# EAGLE design Main_BoardV1 (EAGLE 9.6.2)
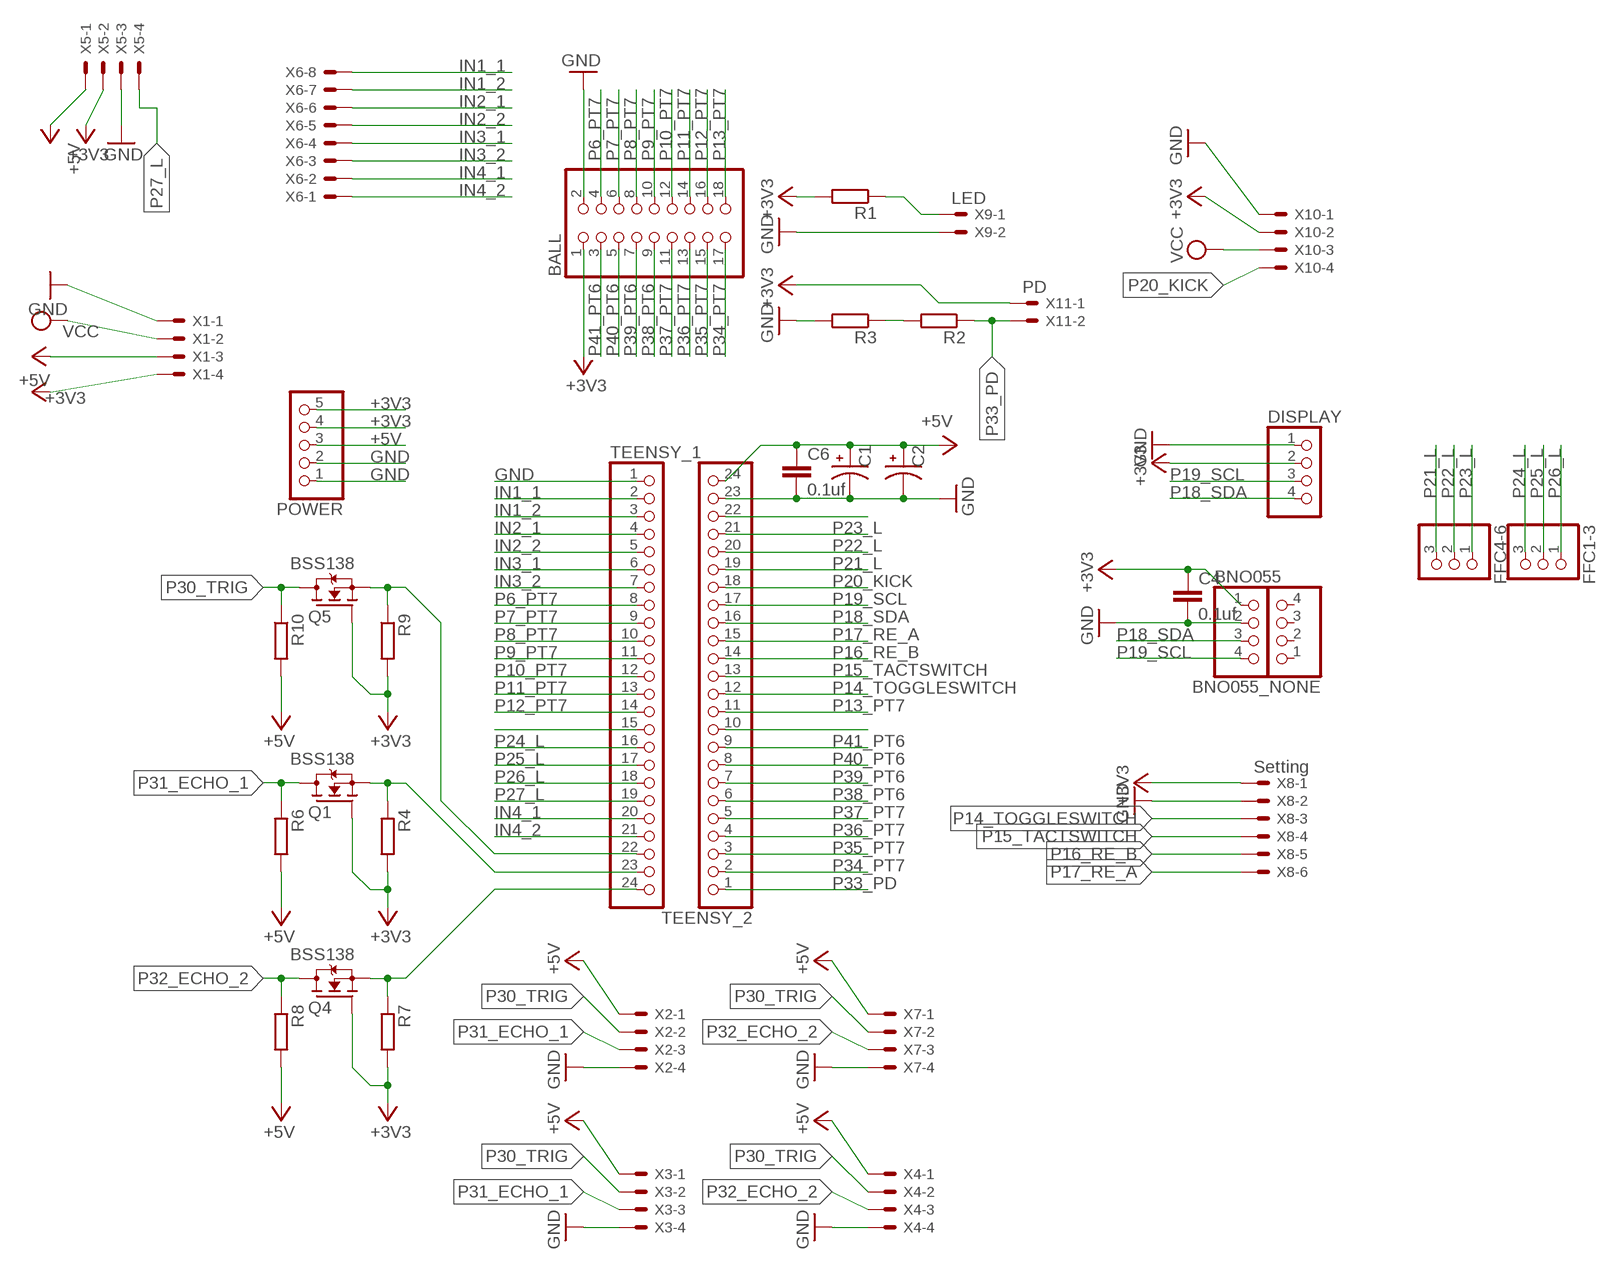
[diagram p0: schematic, sheet 1]

## Parts
BALL  PINHD-2X9  [2X09]
BNO055  PINHD-1X4  [1X04]
BNO055_NONE  PINHD-1X4  [1X04]
C1  EEEFK1E332AM  [CAP_EEEFK1E332AM]
C2  EEEFK1E332AM  [CAP_EEEFK1E332AM]
C4  0.1uf  C-EUC0603  [C0603]
C6  0.1uf  C-EUC0603  [C0603]
DISPLAY  PINHD-1X04_2.54-S  [1X04-S]
FFC1-3  PINHD-1X03_2.54-S  [1X03-S]
FFC4-6  PINHD-1X03_2.54-S  [1X03-S]
POWER  PINHD-1X05_2.54-S  [1X05-S]
Q1  BSS138  [SOT95P240X111-3N]
Q4  BSS138  [SOT95P240X111-3N]
Q5  BSS138  [SOT95P240X111-3N]
R1  R-EU_R0603  [R0603]
R2  R-EU_R0603  [R0603]
R3  R-EU_R0603  [R0603]
R4  R-EU_R0603  [R0603]
R6  R-EU_R0603  [R0603]
R7  R-EU_R0603  [R0603]
R8  R-EU_R0603  [R0603]
R9  R-EU_R0603  [R0603]
R10  R-EU_R0603  [R0603]
TEENSY_1  PINHD-1X24  [1X24]
TEENSY_2  PINHD-1X24  [1X24]
X1  Power  JST-XH-04-PIN-LONG-PAD  [JST-XH-04-PACKAGE-LONG-PAD]
X2  JST-XH-04-PIN-LONG-PAD  [JST-XH-04-PACKAGE-LONG-PAD]
X3  JST-XH-04-PIN-LONG-PAD  [JST-XH-04-PACKAGE-LONG-PAD]
X4  JST-XH-04-PIN-LONG-PAD  [JST-XH-04-PACKAGE-LONG-PAD]
X5  JST-XH-04-PIN-ROUND-PAD  [JST-XH-04-PACKAGE-ROUND-PAD]
X6  Motor  JST-XH-08-PIN-ROUND-PAD  [JST-XH-08-PACKAGE-ROUND-PAD]
X7  JST-XH-04-PIN-LONG-PAD  [JST-XH-04-PACKAGE-LONG-PAD]
X8  Setting  JST-XH-06-PIN-ROUND-PAD  [JST-XH-06-PACKAGE-ROUND-PAD]
X9  LED  JST-XH-02-PIN-ROUND-PAD  [JST-XH-02-PACKAGE-ROUND-PAD]
X10  Kicker  JST-XH-04-PIN-ROUND-PAD  [JST-XH-04-PACKAGE-ROUND-PAD]
X11  PD  JST-XH-02-PIN-ROUND-PAD  [JST-XH-02-PACKAGE-ROUND-PAD]

## Nets
+3V3: BALL.1 BNO055.1 C4.1 DISPLAY.2 POWER.4 POWER.5 Q1.1(G) Q4.1(G) Q5.1(G) R1.2 R4.2 R7.2 R9.2 X1.4 X5.2 X8.1 X10.2 X11.1
+5V: C1.1 C2.1 C6.1 POWER.3 R6.2 R8.2 R10.2 TEENSY_2.24 X1.3 X2.1 X3.1 X4.1 X5.1 X7.1
GND: BALL.2 BNO055.2 C1.2 C2.2 C4.2 C6.2 DISPLAY.1 POWER.1 POWER.2 R3.2 TEENSY_1.1 TEENSY_2.23 X1.1 X2.4 X3.4 X4.4 X5.3 X7.4 X8.2 X9.2 X10.1
IN1_1: TEENSY_1.2 X6.8
IN1_2: TEENSY_1.3 X6.7
IN2_1: TEENSY_1.4 X6.6
IN2_2: TEENSY_1.5 X6.5
IN3_1: TEENSY_1.6 X6.4
IN3_2: TEENSY_1.7 X6.3
IN4_1: TEENSY_1.20 X6.2
IN4_2: TEENSY_1.21 X6.1
N$1: R1.1 X9.1
N$2: R2.2 R3.1
N$3: TEENSY_2.22
N$5: Q1.2(S) R4.1 TEENSY_1.23
N$7: Q4.2(S) R7.1 TEENSY_1.24
N$9: Q5.2(S) R9.1 TEENSY_1.22
N$16: TEENSY_2.10
N$35: TEENSY_1.15
P6_PT7: BALL.4 TEENSY_1.8
P7_PT7: BALL.6 TEENSY_1.9
P8_PT7: BALL.8 TEENSY_1.10
P9_PT7: BALL.10 TEENSY_1.11
P10_PT7: BALL.12 TEENSY_1.12
P11_PT7: BALL.14 TEENSY_1.13
P12_PT7: BALL.16 TEENSY_1.14
P13_PT7: BALL.18 TEENSY_2.11
P14_TOGGLESWITCH: TEENSY_2.12 X8.3
P15_TACTSWITCH: TEENSY_2.13 X8.4
P16_RE_B: TEENSY_2.14 X8.5
P17_RE_A: TEENSY_2.15 X8.6
P18_SDA: BNO055.3 DISPLAY.4 TEENSY_2.16
P19_SCL: BNO055.4 DISPLAY.3 TEENSY_2.17
P20_KICK: TEENSY_2.18 X10.4
P21_L: FFC4-6.3 TEENSY_2.19
P22_L: FFC4-6.2 TEENSY_2.20
P23_L: FFC4-6.1 TEENSY_2.21
P24_L: FFC1-3.3 TEENSY_1.16
P25_L: FFC1-3.2 TEENSY_1.17
P26_L: FFC1-3.1 TEENSY_1.18
P27_L: TEENSY_1.19 X5.4
P30_TRIG: Q5.3(D) R10.1 X2.2 X3.2 X4.2 X7.2
P31_ECHO_1: Q1.3(D) R6.1 X2.3 X3.3
P32_ECHO_2: Q4.3(D) R8.1 X4.3 X7.3
P33_PD: R2.1 TEENSY_2.1 X11.2
P34_PT7: BALL.17 TEENSY_2.2
P35_PT7: BALL.15 TEENSY_2.3
P36_PT7: BALL.13 TEENSY_2.4
P37_PT7: BALL.11 TEENSY_2.5
P38_PT6: BALL.9 TEENSY_2.6
P39_PT6: BALL.7 TEENSY_2.7
P40_PT6: BALL.5 TEENSY_2.8
P41_PT6: BALL.3 TEENSY_2.9
VCC: X1.2 X10.3
Unconnected: BNO055_NONE.1 BNO055_NONE.2 BNO055_NONE.3 BNO055_NONE.4

## Library data of the parts
BALL = pinhead:PINHD-2X9: PIN HEADER
BNO055 BNO055_NONE = pinhead:PINHD-1X4: PIN HEADER
C1 C2 = EEEFK1E332AM:EEEFK1E332AM: Check availability <https://pricing.snapeda.com/parts/EEEFK1E332AM/Panasonic/view-part?ref=eda>; AVAILABILITY: In Stock; DESCRIPTION: 3300µF 25V Aluminum Electrolytic Capacitors Radial, Can - SMD 5000 Hrs @ 105°C; MF: Panasonic; MP: EEEFK1E332AM; PACKAGE: RADIAL-2 Panasonic; PRICE: None; PURCHASE-URL: https://pricing.snapeda.com/search/part/EEEFK1E332AM/?ref=eda
C4 C6 = rcl:C-EU: CAPACITOR, European symbol; SPICEPREFIX: C
DISPLAY = pinhead-2:PINHD-1X04: PIN HEADER
FFC1-3 FFC4-6 = pinhead-2:PINHD-1X03: PIN HEADER
POWER = pinhead-2:PINHD-1X05: PIN HEADER
Q1 Q4 Q5 = BSS138:BSS138: N-Channel 50V 220mA (Ta) 360mW (Ta) Surface Mount SOT-23-3 Check availability <https://pricing.snapeda.com/parts/BSS138/ON%20Semiconductor/view-part?ref=eda>; AVAILABILITY: In Stock; DESCRIPTION: N-Channel 50 V 200mA (Ta) 225mW (Ta) Surface Mount SOT-23-3 (TO-236); MF: ON Semiconductor; MP: BSS138; PACKAGE: SOT-23 ON; PRICE: None; PURCHASE-URL: https://pricing.snapeda.com/search/part/BSS138/?ref=eda
R1-R4 R6-R10 = rcl:R-EU_: RESISTOR, European symbol; SPICEPREFIX: R
TEENSY_1 TEENSY_2 = pinhead:PINHD-1X24: PIN HEADER
X1-X4 X7 X10 = JST XH Connectors v1-0:JST-XH-04-PIN: JST XH Connector 2 Pin Wire to board connector. Pitch: 2,54 mm, (0.100") Number of pins: 4 Created by Rembrandt Electronics www.rembrandtelectronics.com
X5 = Rembrandt Electronics - JST XH Connectors v1-0:JST-XH-04-PIN: JST XH Connector 2 Pin Wire to board connector. Pitch: 2,54 mm, (0.100") Number of pins: 4 Created by Rembrandt Electronics www.rembrandtelectronics.com
X6 = Rembrandt Electronics - JST XH Connectors v1-0:JST-XH-08-PIN: JST XH Connector 2 Pin Wire to board connector. Pitch: 2,54 mm, (0.100") Number of pins: 8 Created by Rembrandt Electronics www.rembrandtelectronics.com
X8 = JST XH Connectors v1-0:JST-XH-06-PIN: JST XH Connector 2 Pin Wire to board connector. Pitch: 2,54 mm, (0.100") Number of pins: 6 Created by Rembrandt Electronics www.rembrandtelectronics.com
X9 X11 = JST XH Connectors v1-0:JST-XH-02-PIN: JST XH Connector 2 Pin Wire to board connector. Pitch: 2,54 mm, (0.100") Number of pins: 2 Created by Rembrandt Electronics www.rembrandtelectronics.com

## Board
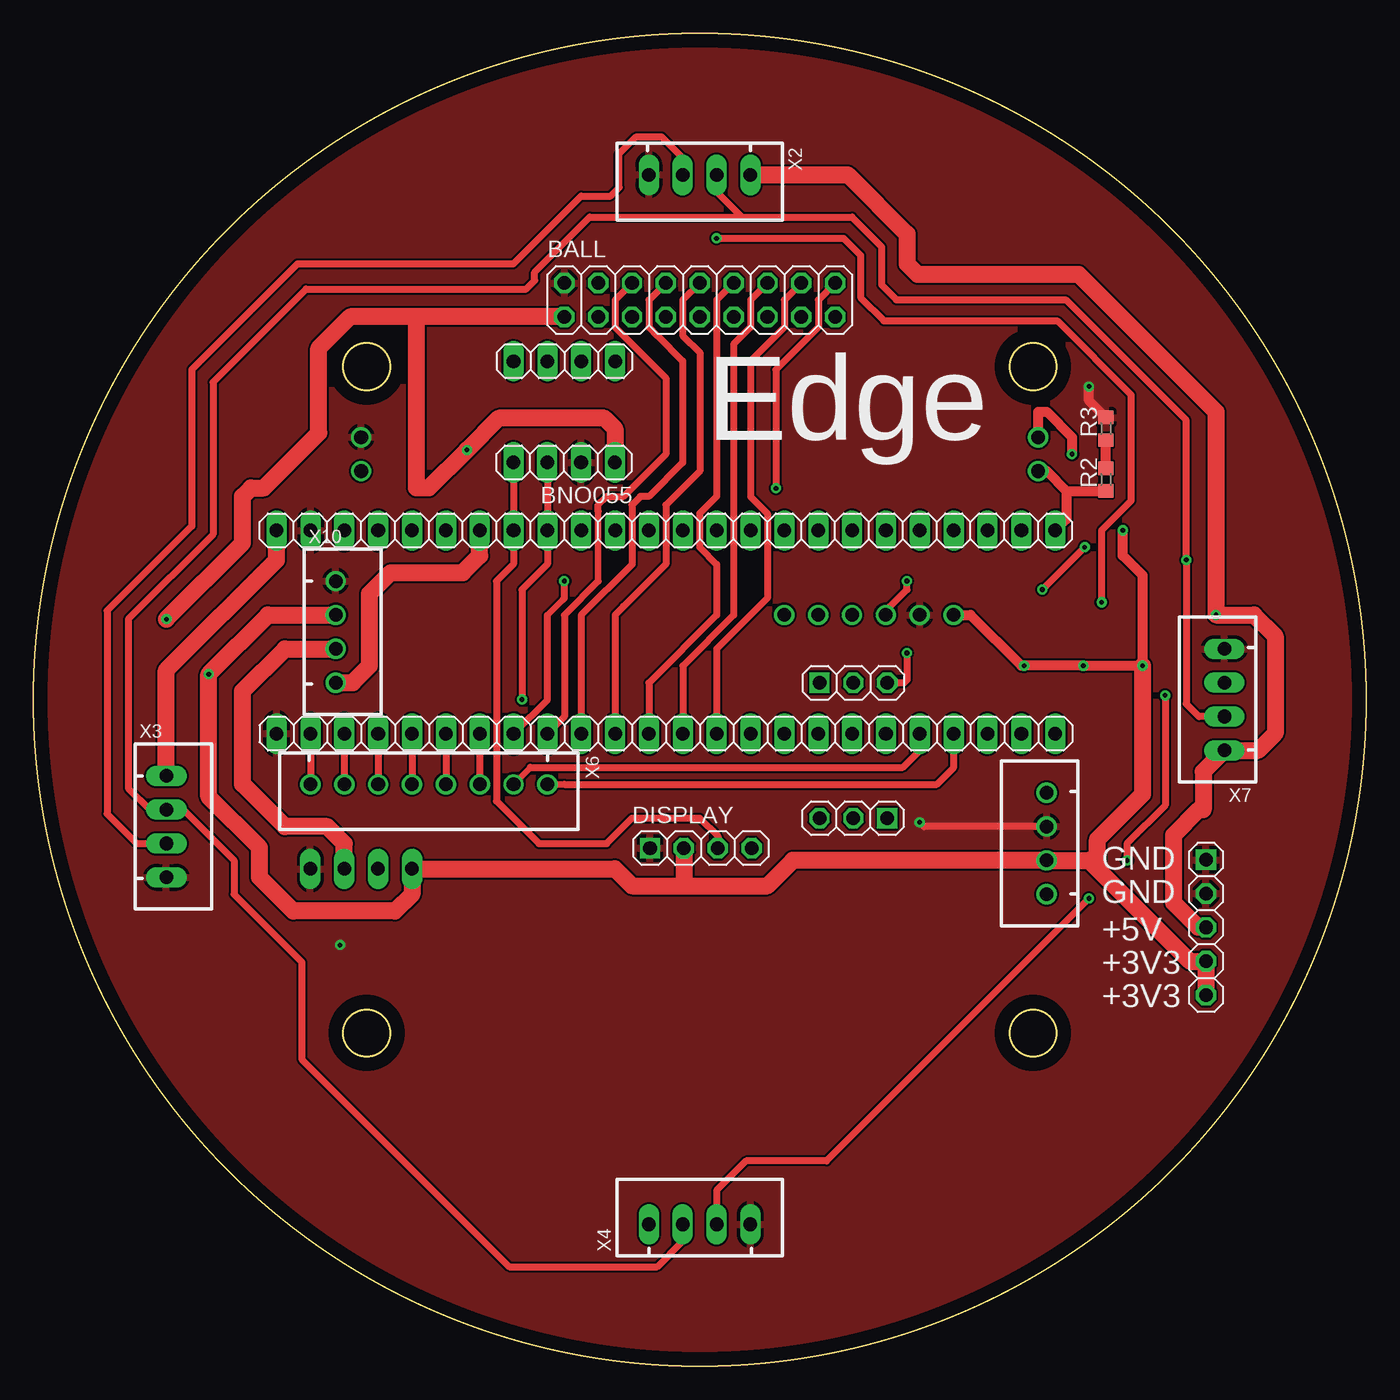
[diagram p1: board, top side]
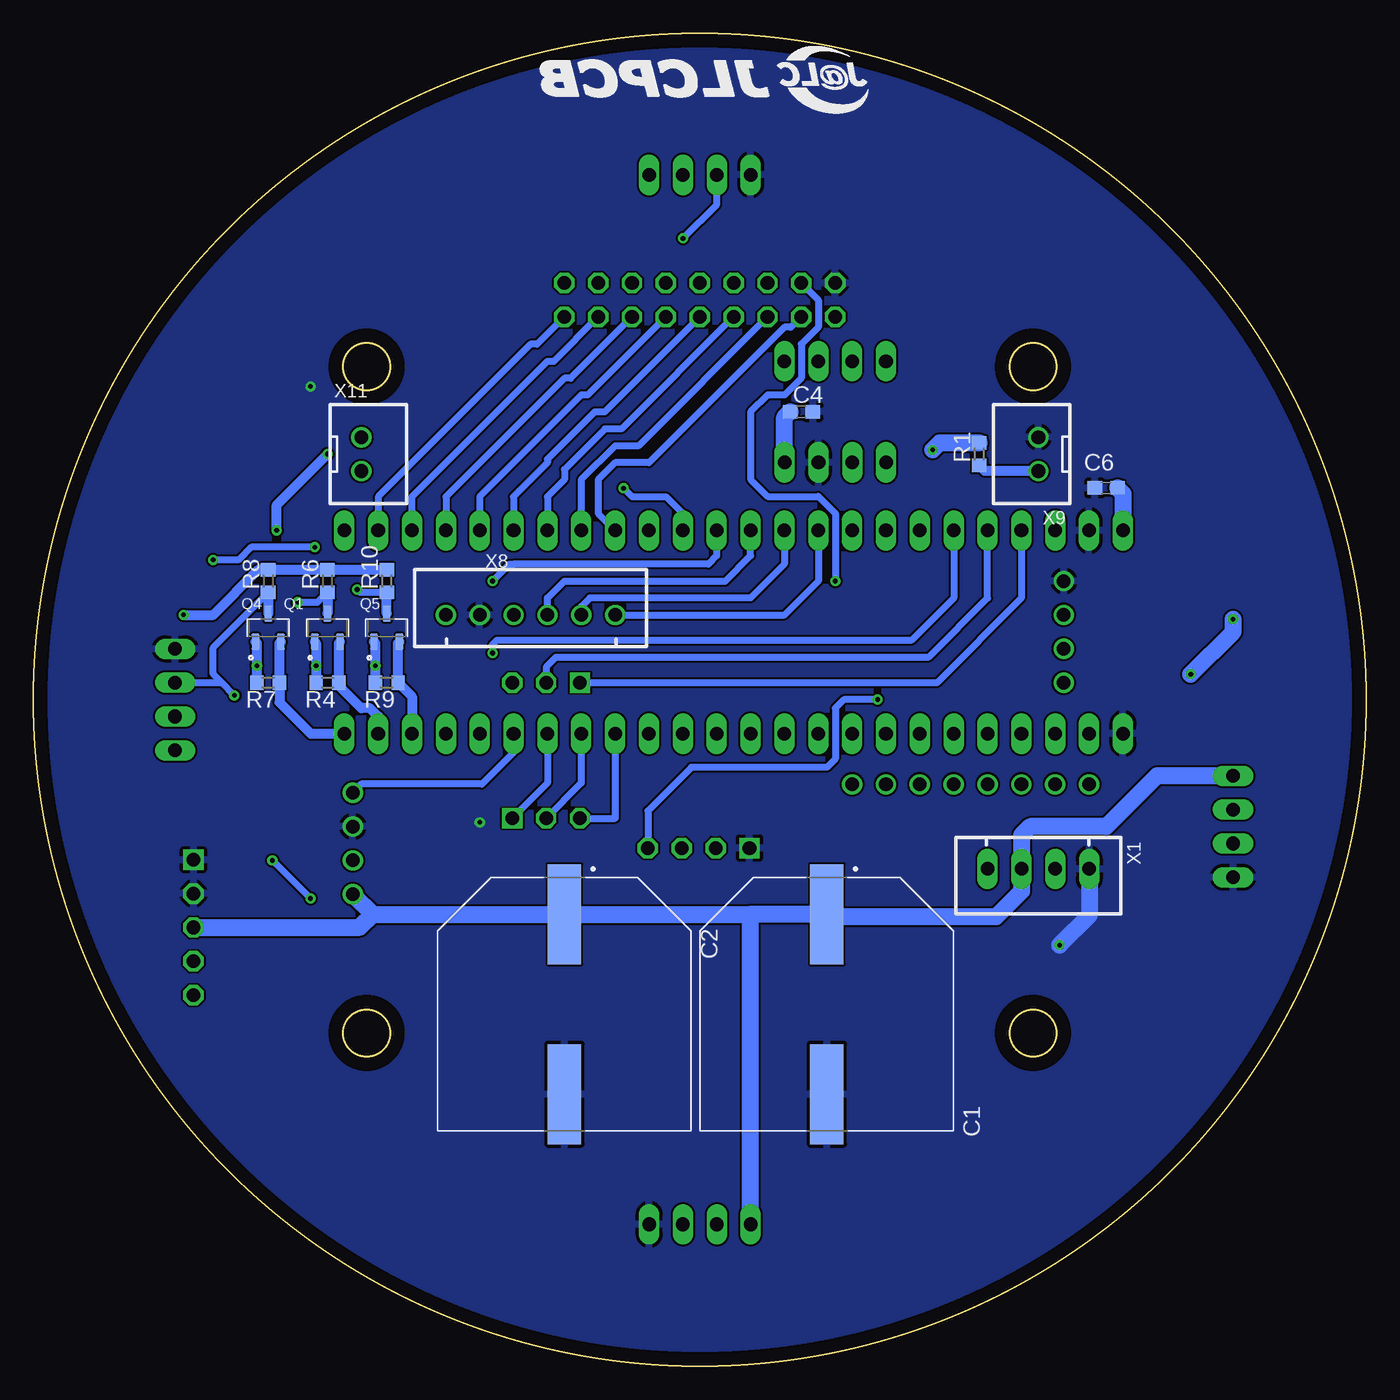
[diagram p2: board, bottom side, seen from below]

Size 100 x 100 mm. Coordinates in mm from the lower left corner, seen from the top.
Outline: circle at 50,50 radius 50
Outline: circle at 75,75 radius 1.75
Outline: circle at 25,75 radius 1.75
Outline: circle at 25,25 radius 1.75
Outline: circle at 75,25 radius 1.75
Copper layers (1*16): Top 0.035mm / dielectric 1.5mm / Bottom 0.035mm
Design rules "default": minimum track width 6mil, minimum drill 0.35mm, track to track 6mil, track to pad 6mil, pad to pad 6mil, via to via 6mil, smd to smd 6mil, copper to edge 40mil, drill to drill 6mil, minimum pad ring 10mil, minimum via ring 8mil, stop-mask expansion 4mil, vias tented up to drill 0mil, thermal gap 10mil

### Footprints (pad centres in the part's own frame; a part is rotated, then mirrored left to right if it is on the bottom)
2X09 = drill 1.016 octagon: 1 -10.16,-1.27; 2 -10.16,1.27; 3 -7.62,-1.27; 4 -7.62,1.27; 5 -5.08,-1.27; 6 -5.08,1.27; 7 -2.54,-1.27; 8 -2.54,1.27; 9 0,-1.27; 10 0,1.27; 11 2.54,-1.27; 12 2.54,1.27; 13 5.08,-1.27; 14 5.08,1.27; 15 7.62,-1.27; 16 7.62,1.27; 17 10.16,-1.27; 18 10.16,1.27
1X04 = drill 1.016 long: 1 -3.81,0; 2 -1.27,0; 3 1.27,0; 4 3.81,0
CAP_EEEFK1E332AM = smd 7.5 x 2.5: 1 -6.75,0; 2 6.75,0
C0603 = smd 1.1 x 1: 1 -0.85,0; 2 0.85,0
1X04-S = drill 1.016 square: 1 -3.81,0 | drill 1.016 octagon: 2 -1.27,0; 3 1.27,0; 4 3.81,0
1X03-S = drill 1.016 square: 1 -2.54,0 | drill 1.016 octagon: 2 0,0; 3 2.54,0
1X05-S = drill 1.016 square: 1 -5.08,0 | drill 1.016 octagon: 2 -2.54,0; 3 0,0; 4 2.54,0; 5 5.08,0
SOT95P240X111-3N = smd 1.23 x 0.6: 1 -1.06,0.95; 2 -1.06,-0.95; 3 1.06,0
R0603 = smd 1 x 1.1: 1 -0.85,0; 2 0.85,0
1X24 = drill 1.016 long: 1 -29.21,0; 2 -26.67,0; 3 -24.13,0; 4 -21.59,0; 5 -19.05,0; 6 -16.51,0; 7 -13.97,0; 8 -11.43,0; 9 -8.89,0; 10 -6.35,0; 11 -3.81,0; 12 -1.27,0; 13 1.27,0; 14 3.81,0; 15 6.35,0; 16 8.89,0; 17 11.43,0; 18 13.97,0; 19 16.51,0; 20 19.05,0; 21 21.59,0; 22 24.13,0; 23 26.67,0; 24 29.21,0
JST-XH-04-PACKAGE-LONG-PAD = drill 1.016 long: 1 -3.81,0; 2 -1.27,0; 3 1.27,0; 4 3.81,0
JST-XH-04-PACKAGE-ROUND-PAD = drill 1.016: 1 -3.81,0; 2 -1.27,0; 3 1.27,0; 4 3.81,0
JST-XH-08-PACKAGE-ROUND-PAD = drill 1.016: 1 -8.89,0; 2 -6.35,0; 3 -3.81,0; 4 -1.27,0; 5 1.27,0; 6 3.81,0; 7 6.35,0; 8 8.89,0
JST-XH-06-PACKAGE-ROUND-PAD = drill 1.016: 1 -6.35,0; 2 -3.81,0; 3 -1.27,0; 4 1.27,0; 5 3.81,0; 6 6.35,0
JST-XH-02-PACKAGE-ROUND-PAD = drill 1.016: 1 -1.27,0; 2 1.27,0

### Placement (x,y rotation side)
BALL  50,80 0 top
BNO055  39.82,67.81 180 top
BNO055_NONE  39.84,75.4 0 top
C1  40.47,27.15 270 bottom
C2  60.15,27.15 270 bottom
C4  42.37,71.6 0 bottom
C6  19.51,65.89 180 bottom
DISPLAY  50.08,38.87 0 top
FFC1-3  61.52,41.11 180 top
FFC4-6  61.52,51.27 0 top
POWER  87.98,32.92 270 top
Q1  77.93,55.41 90 bottom
Q4  82.38,55.41 90 bottom
Q5  73.49,55.41 90 bottom
R1  29.04,68.43 90 bottom
R2  80.47,66.52 90 top
R3  80.47,70.33 90 top
R4  77.93,51.28 180 bottom
R6  77.93,58.9 90 bottom
R7  82.38,51.28 180 bottom
R8  82.38,58.9 90 bottom
R9  73.49,51.28 180 bottom
R10  73.49,58.9 90 bottom
TEENSY_1  47.46,47.46 0 top
TEENSY_2  47.46,62.7 180 top
X1  24.59,37.31 180 bottom
X2  49.99,89.38 180 top
X3  9.99,40.49 270 top
X4  49.99,10.64 0 top
X5  76.03,39.22 90 top
X6  29.68,43.65 180 top
X7  89.36,50.01 90 top
X8  62.69,56.36 0 bottom
X9  24.59,68.43 90 bottom
X10  22.69,55.09 270 top
X11  75.39,68.43 270 bottom

### Tracks (layer width: path | path; a pad name or v marks a point on that pad's centre or on a via)
+3V3  (via drill 0.35)
  Top 0.762: X8.1 70.31,56.36 74.12,52.55 v74.34,52.55 v78.78,52.55 v83.23,52.55 83.23,59.32 81.74,60.81 v81.74,62.71 | X11.1 75.39,71.6 76.03,71.6 77.93,69.7 v77.93,68.43
  Top 1.27: BNO055.1 43.64,70.33 42.85,71.13 34.91,71.13 v32.53,68.75 29.67,65.89 28.72,65.89 28.72,78.73 | POWER.5 POWER.4 86.77,30.38 79.84,37.31 | 48.72,36.04 44.91,36.04 43.64,37.31 X1.4 28.4,35.41 27.13,34.14 19.51,34.14 16.97,36.68 16.97,38.9 13.16,42.71 v13.16,51.92 17.61,56.36 X10.2 | 48.72,36.04 55.07,36.04 56.98,37.95 X5.2 79.2,37.95 79.84,37.31 | DISPLAY.2 48.81,36.13 48.72,36.04 | 79.84,37.31 79.84,39.54 83.23,42.92 v83.23,52.55 | v9.99,56.04 15.7,61.76 15.7,65.25 16.34,65.89 17.29,65.89 21.42,70.02 21.42,76.36 23.78,78.73 28.72,78.73 | BALL.1 28.72,78.73
  Bottom 0.762: Q1.1 78.78,54.25 v78.78,52.55 R4.2 | Q4.1 83.23,54.25 v83.23,52.55 R7.2 | R9.2 v74.34,52.55 74.34,54.25 Q5.1 | v81.74,62.71 81.74,64.62 v77.93,68.43
  Bottom 1.27: BNO055.1 43.63,71.19 C4.1 | v32.53,68.75 32,69.28 R1.2 | v13.16,51.92 9.99,55.09 v9.99,56.04
+5V  (via drill 0.35)
  Top 1.27: X2.1 61.11,89.38 65.55,84.94 65.55,82.72 66.34,81.92 78.41,81.92 88.73,71.6 v88.73,56.36 91.59,56.36 93.17,54.78 93.17,47.47 91.9,46.2 X7.1 87.77,44.62 87.77,41.76 87.46,41.76 85.55,39.85 85.55,34.77 87.41,32.92 POWER.3 | TEENSY_2.24 18.25,60.48 9.99,52.21 X3.1
  Bottom 0.762: R10.2 R6.2 R8.2 83.12,59.75 86.51,56.36 v88.73,56.36
  Bottom 1.27: 46.18,33.9 C1.1 40.28,33.72 27.77,33.72 25.86,35.62 X1.3 25.86,39.85 25.23,40.49 19.51,40.49 15.7,44.3 X3.1 | 46.18,33.9 C2.1 74.52,33.9 | X5.1 74.52,33.9 | POWER.3 75.51,32.92 74.52,33.9 | X4.1 46.18,33.9 | C6.1 18.24,65.47 TEENSY_2.24
GND  (via drill 0.35)
  Top 0.508: X5.3 66.82,40.49 v66.5,40.81
  Top 0.762: R3.2 79.2,72.45 v79.2,73.51
  Bottom 1.27: X1.1 20.78,33.82 v23,31.6
  pour Top: 32.21,97.64 35.39,100.81 52.53,100.81 71.58,100.81 98.25,74.14 101.43,70.97 101.43,34.77 101.43,29.06 74.76,2.39 70.95,-1.42 31.58,-1.42 24.59,-1.42 20.15,3.02 -1.44,24.61 -1.44,58.27 -1.44,70.97 21.42,93.83 25.23,97.64
  pour Bottom: 32.21,97.64 35.39,100.81 71.58,100.81 101.43,70.97 101.43,29.06 70.95,-1.42 24.59,-1.42 -1.44,24.61 -1.44,70.97 25.23,97.64
IN1_1
  Top 0.508: TEENSY_1.2 X6.8
IN1_2
  Top 0.508: TEENSY_1.3 X6.7
IN2_1
  Top 0.508: TEENSY_1.4 X6.6
IN2_2
  Top 0.508: TEENSY_1.5 X6.5
IN3_1
  Top 0.508: TEENSY_1.6 X6.4
IN3_2
  Top 0.508: TEENSY_1.7 X6.3
IN4_1
  Top 0.5: X6.2 37.3,44.92
  Top 0.508: TEENSY_1.20 66.51,46.19 65.24,44.92 37.3,44.92
IN4_2
  Top 0.5: X6.1 39.84,43.65
  Top 0.508: TEENSY_1.21 69.05,44.92 67.78,43.65 39.84,43.65
N$1
  Bottom 0.762: R1.1 28.62,67.16 X9.1
N$2
  Top 0.762: R2.2 R3.1
N$5
  Bottom 0.762: Q1.2 77.08,54.25 R4.1 77.08,51.07 75.39,49.38 74.76,49.38 74.13,48.75 TEENSY_1.23
N$7
  Bottom 0.762: Q4.2 81.53,54.25 R7.1 81.53,49.8 79.19,47.46 TEENSY_1.24
N$9
  Bottom 0.762: Q5.2 72.64,54.25 R9.1 71.59,50.24 TEENSY_1.22
P6_PT7  (via drill 0.35)
  Top 0.5: 38.57,56.35 39.73,57.51
  Top 0.508: TEENSY_1.8 38.57,50 38.57,56.35 | 39.73,57.51 39.83,57.61 v39.83,58.9
  Bottom 0.508: BALL.4 41.1,79.99 41.1,77.95 42.37,76.68 42.37,74.14 43.64,72.87 44.91,72.87 46.18,71.6 46.18,66.52 44.91,65.25 41.1,65.25 39.83,63.98 v39.83,58.9
P7_PT7
  Top 0.5: 42.38,58.89 42.38,64.12
  Top 0.508: BALL.6 43.65,80 43.65,77.94 45.54,76.05 45.55,76.05 47.45,74.14 47.45,68.43 44.28,65.25 43.01,65.25 42.38,64.63 42.38,64.12 | TEENSY_1.9 39.84,48.73 39.84,56.35 42.38,58.89
P8_PT7
  Top 0.508: BALL.8 46.19,80 46.19,77.94 46.81,77.32 46.82,77.32 48.72,75.41 48.72,67.79 46.18,65.25 45.55,65.25 44.91,64.62 44.91,60.17 44.92,60.16 41.11,56.35 TEENSY_1.10
P9_PT7
  Top 0.508: TEENSY_1.11 43.65,56.37 44.28,57 47.45,60.17 47.45,64.62 50,67.17 50,76.05 48.72,77.33 48.72,79.99 BALL.10
P10_PT7
  Top 0.508: BALL.12 51.27,80 51.27,65.26 49.99,63.98 49.99,61.44 51.27,60.16 51.27,56.35 46.19,51.27 TEENSY_1.12
P11_PT7
  Top 0.508: BALL.14 53.81,80 53.81,77.94 52.54,76.67 52.54,56.35 48.73,52.54 TEENSY_1.13
P12_PT7
  Top 0.508: BALL.16 56.35,80 56.35,77.94 53.81,75.4 53.81,65.24 55.08,63.97 55.08,57.62 51.27,53.81 TEENSY_1.14
P13_PT7  (via drill 0.35)
  Top 0.508: BALL.18 58.89,80 58.89,77.94 55.72,74.76 v55.72,65.87
  Bottom 0.508: v55.72,65.87 55.08,65.24 52.54,65.24 51.27,63.97 TEENSY_2.11
P14_TOGGLESWITCH  (via drill 0.35)
  Top 0.508: X8.3 63.96,56.68 65.55,58.27 v65.55,58.9
  Bottom 0.508: TEENSY_2.12 48.73,60.8 49.36,60.17 63.96,60.17 64.28,60.17 v65.55,58.9
P15_TACTSWITCH
  Bottom 0.508: TEENSY_2.13 46.18,60.81 48.09,58.9 60.15,58.9 61.42,57.63 X8.4
P16_RE_B
  Bottom 0.508: TEENSY_2.14 43.65,60.18 43.65,60.16 46.18,57.63 58.25,57.63 58.88,57 X8.5
P17_RE_A
  Bottom 0.508: TEENSY_2.15 41.11,58.89 43.64,56.36 X8.6
P18_SDA  (via drill 0.35)
  Top 0.508: BNO055.3 38.57,67.79 TEENSY_2.16 38.57,60.18 36.66,58.27 v36.66,50.01
  Bottom 0.508: DISPLAY.4 53.89,41.67 50.63,44.93 40.47,44.93 39.83,45.57 39.83,49.38 39.2,50.01 v36.66,50.01
P19_SCL
  Top 0.508: BNO055.4 36.03,67.79 TEENSY_2.17 36.03,60.18 34.75,58.9 34.75,42.39 37.93,39.22 43.01,39.22 44.91,41.12 49.99,41.12 51.35,39.76 DISPLAY.3
P20_KICK
  Top 1.27: TEENSY_2.18 33.49,60.82 32.21,59.54 26.82,59.54 25.23,57.95 25.23,52.55 23.96,51.28 X10.4
P21_L  (via drill 0.35)
  Top 0.508: v65.55,53.51 65.55,51.48 65.34,51.27 FFC4-6.3
  Bottom 0.508: TEENSY_2.19 30.95,57.62 34.13,54.44 46.8,54.44 46.82,54.46 65.23,54.46 65.55,54.14 v65.55,53.51
P22_L
  Bottom 0.508: TEENSY_2.20 28.41,57.62 32.86,53.17 60.8,53.17 61.53,52.45 FFC4-6.2
P23_L
  Bottom 0.508: TEENSY_2.21 25.87,57.62 32.22,51.27 FFC4-6.1
P24_L
  Bottom 0.508: TEENSY_1.16 56.35,41.11 FFC1-3.3
P25_L
  Bottom 0.508: FFC1-3.2 58.89,43.74 TEENSY_1.17
P26_L
  Bottom 0.508: TEENSY_1.18 61.43,43.74 FFC1-3.1
P27_L
  Bottom 0.508: TEENSY_1.19 63.97,46.03 66.34,43.66 75.39,43.66 X5.4
P30_TRIG  (via drill 0.35)
  Top 0.508: 53.17,86.21 51.26,88.11 X2.2 | 53.17,86.21 61.42,86.21 63.64,83.98 63.64,81.13 64.76,80.02 77.46,80.02 86.51,70.97 v86.51,60.49 86.51,49.69 87.46,48.74 X7.2 | X4.2 48.72,9.37 46.82,7.47 35.71,7.47 20.15,23.02 20.15,30.33 15.07,35.41 15.07,37.95 11.26,41.76 X3.2 8.72,41.76 7.13,43.34 7.13,56.04 13.48,62.4 13.48,73.82 20.47,80.81 36.97,80.81 37.61,81.45 37.61,82.08 41.74,86.21 53.17,86.21 | v75.71,58.27 v78.88,61.44
  Bottom 0.508: R10.1 75.5,58.05 v75.71,58.27 | v78.88,61.44 83.65,61.44 84.6,60.49 v86.51,60.49
  Bottom 0.762: Q5.3 R10.1
P31_ECHO_1  (via drill 0.35)
  Top 0.508: v80.16,57.32 80.16,62.08 80.16,62.71 82.38,64.93 82.38,72.87 76.82,78.43 63.8,78.43 62.06,80.18 62.06,83.35 60.79,84.62 v51.26,84.62 | X2.3 48.72,90.65 47.14,92.24 45.23,92.24 43.96,90.97 43.96,88.43 43.32,87.79 41.1,87.79 36.02,82.72 19.83,82.72 11.89,74.78 11.89,63.03 5.54,56.68 5.54,41.44 7.77,39.22 X3.3
  Bottom 0.508: v80.16,57.32 78.67,57.32 R6.1 | v51.26,84.62 48.72,87.16 X2.3
  Bottom 0.762: R6.1 Q1.3
P32_ECHO_2  (via drill 0.35)
  Top 0.508: v82.06,37.95 82.06,39.22 84.92,42.07 v84.92,50.33 | v79.2,35.09 59.52,15.4 53.49,15.4 51.26,13.18 X4.3
  Bottom 0.508: R8.1 86.51,53.93 86.51,51.92 85.87,51.28 | v82.06,37.95 v79.2,35.09 | v84.92,50.33 85.87,51.28 | X7.3 85.87,51.28
  Bottom 0.762: R8.1 Q4.3
P33_PD
  Top 0.762: X11.2 76.03,67.16 77.51,65.67 | 77.51,65.67 R2.1 | 77.51,65.67 77.51,63.54 TEENSY_2.1
P34_PT7
  Bottom 0.508: BALL.17 62.22,76.67 62.7,76.67 74.13,65.24 TEENSY_2.2
P35_PT7
  Bottom 0.508: TEENSY_2.3 71.59,65.24 61.43,75.4 60.95,75.4 BALL.15
P36_PT7
  Bottom 0.508: BALL.13 59.68,74.13 60.16,74.13 69.05,65.24 TEENSY_2.4
P37_PT7
  Bottom 0.508: BALL.11 58.41,72.86 58.89,72.86 66.51,65.24 TEENSY_2.5
P38_PT6
  Bottom 0.508: BALL.9 57.14,71.59 57.89,71.59 61.43,68.05 61.43,67.78 63.97,65.24 TEENSY_2.6
P39_PT6
  Bottom 0.508: BALL.7 55.87,70.32 57.12,70.32 60.16,67.28 60.16,66.51 61.43,65.24 TEENSY_2.7
P40_PT6
  Bottom 0.508: BALL.5 54.6,69.05 56.35,69.05 58.89,66.51 TEENSY_2.8
P41_PT6
  Bottom 0.508: BALL.3 43.17,77.94 43.65,77.94 53.81,67.78 56.35,67.78 57.62,66.51 57.62,63.97 TEENSY_2.9
VCC
  Top 1.27: X1.2 23.32,39.22 22.05,40.49 18.88,40.49 15.7,43.66 15.7,50.65 18.88,53.82 X10.3

### Text on the board
tNames: Edge | GND | GND | +5V | +3V3 | +3V3